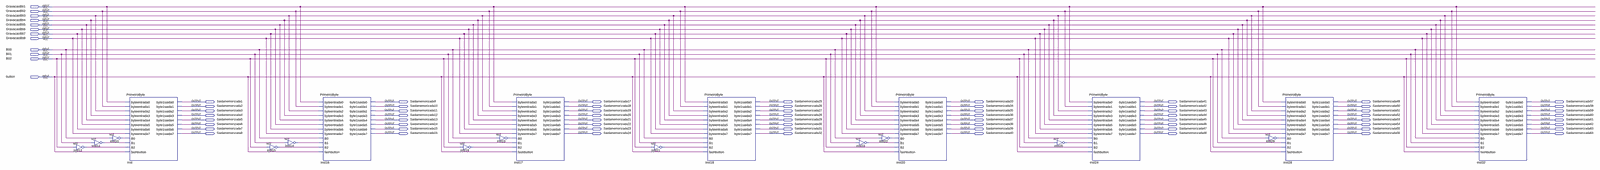
[diagram p0: schematic sheet, whole]
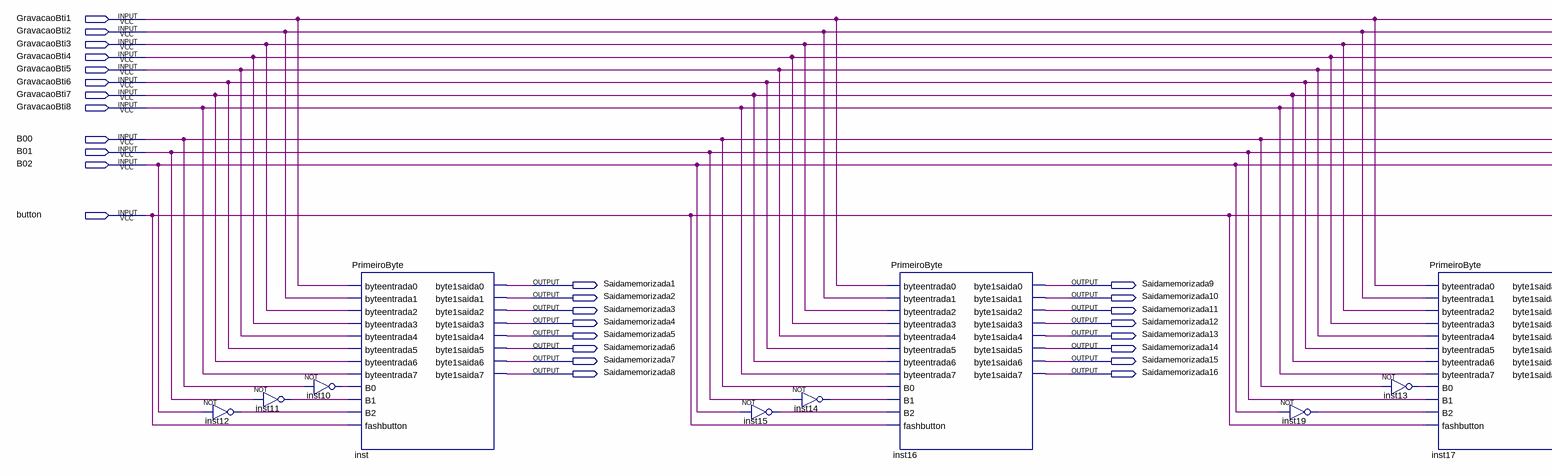
[diagram p1: schematic sheet, left part]
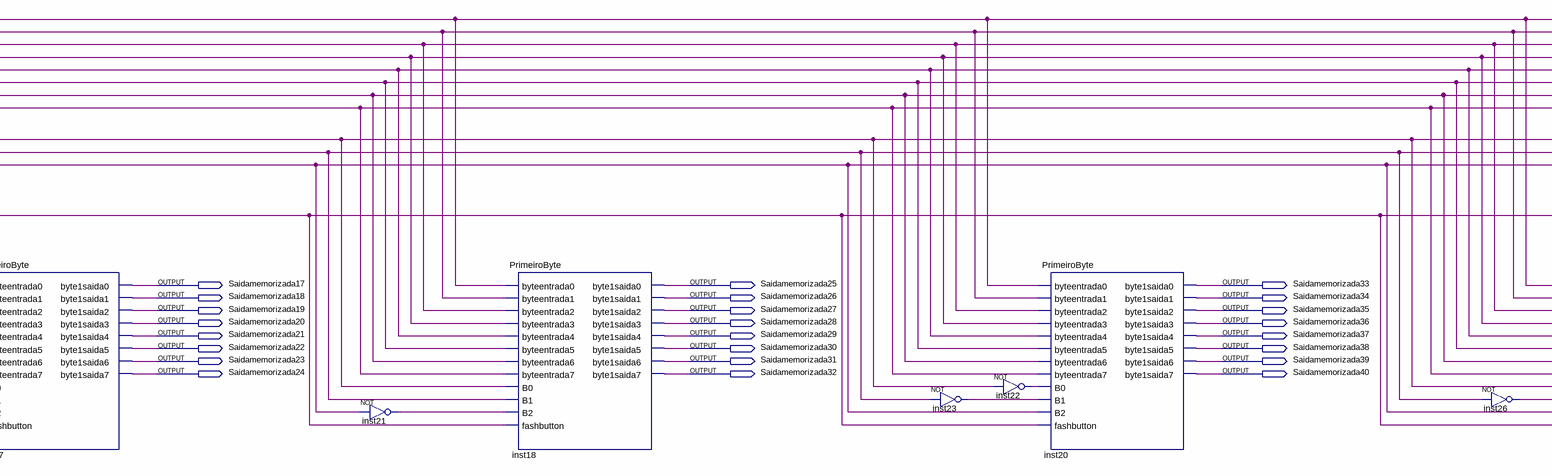
[diagram p2: schematic sheet, centre part]
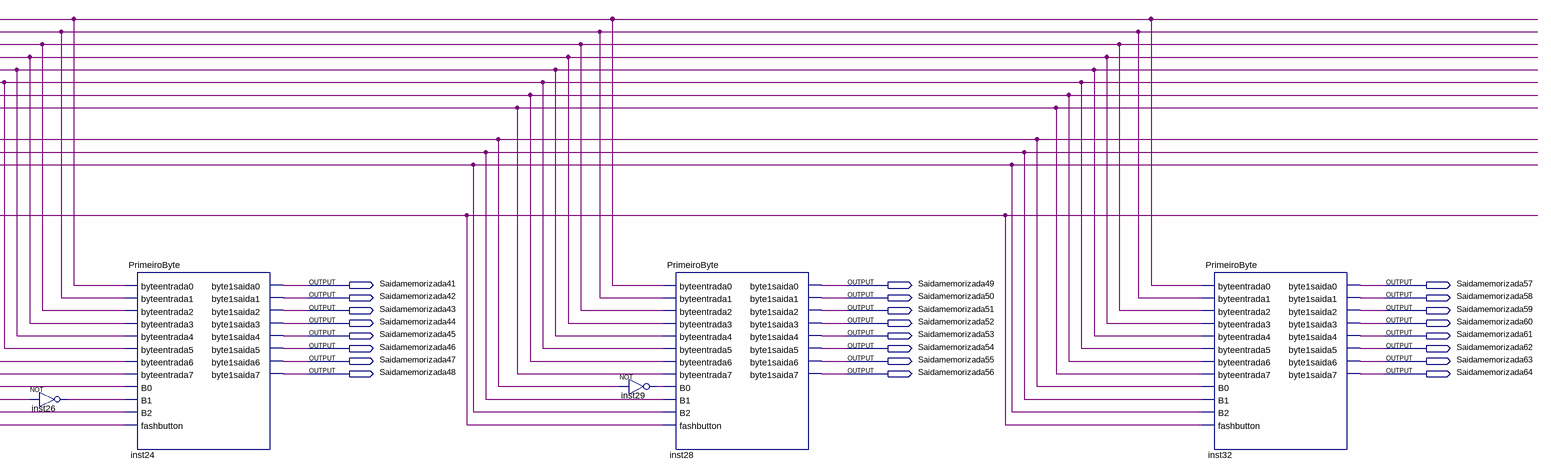
[diagram p3: schematic sheet, right part]
// Quartus schematic MemoriaBiestavel.bdf as structural Verilog: 20 symbols, 76 pins
module MemoriaBiestavel (
  input  GravacaoBti1,
  input  GravacaoBti2,
  input  GravacaoBti3,
  input  GravacaoBti4,
  input  GravacaoBti5,
  input  GravacaoBti6,
  input  GravacaoBti7,
  input  GravacaoBti8,
  input  B00,
  input  B01,
  input  B02,
  input  button,
  output Saidamemorizada1,
  output Saidamemorizada9,
  output Saidamemorizada17,
  output Saidamemorizada25,
  output Saidamemorizada33,
  output Saidamemorizada41,
  output Saidamemorizada49,
  output Saidamemorizada57,
  output Saidamemorizada2,
  output Saidamemorizada10,
  output Saidamemorizada18,
  output Saidamemorizada26,
  output Saidamemorizada34,
  output Saidamemorizada42,
  output Saidamemorizada50,
  output Saidamemorizada58,
  output Saidamemorizada3,
  output Saidamemorizada11,
  output Saidamemorizada19,
  output Saidamemorizada27,
  output Saidamemorizada35,
  output Saidamemorizada43,
  output Saidamemorizada51,
  output Saidamemorizada59,
  output Saidamemorizada4,
  output Saidamemorizada12,
  output Saidamemorizada20,
  output Saidamemorizada28,
  output Saidamemorizada36,
  output Saidamemorizada44,
  output Saidamemorizada52,
  output Saidamemorizada60,
  output Saidamemorizada5,
  output Saidamemorizada13,
  output Saidamemorizada21,
  output Saidamemorizada29,
  output Saidamemorizada37,
  output Saidamemorizada45,
  output Saidamemorizada53,
  output Saidamemorizada61,
  output Saidamemorizada6,
  output Saidamemorizada14,
  output Saidamemorizada22,
  output Saidamemorizada30,
  output Saidamemorizada38,
  output Saidamemorizada46,
  output Saidamemorizada54,
  output Saidamemorizada62,
  output Saidamemorizada7,
  output Saidamemorizada15,
  output Saidamemorizada23,
  output Saidamemorizada31,
  output Saidamemorizada39,
  output Saidamemorizada47,
  output Saidamemorizada55,
  output Saidamemorizada63,
  output Saidamemorizada8,
  output Saidamemorizada16,
  output Saidamemorizada24,
  output Saidamemorizada32,
  output Saidamemorizada40,
  output Saidamemorizada48,
  output Saidamemorizada56,
  output Saidamemorizada64
);

  wire inst10_out, inst11_out, inst12_out, inst13_out, inst14_out, inst15_out, inst19_out, inst21_out,
       inst22_out, inst23_out, inst26_out, inst29_out;

  not inst12 (inst12_out, B02);
  not inst11 (inst11_out, B01);
  not inst10 (inst10_out, B00);
  PrimeiroByte inst (
    .byteentrada0(GravacaoBti1), .byteentrada1(GravacaoBti2), .byteentrada2(GravacaoBti3),
    .byteentrada3(GravacaoBti4), .byteentrada4(GravacaoBti5), .byteentrada5(GravacaoBti6),
    .byteentrada6(GravacaoBti7), .byteentrada7(GravacaoBti8), .B0(inst10_out), .B1(inst11_out),
    .B2(inst12_out), .fashbutton(button), .byte1saida0(Saidamemorizada1), .byte1saida1(Saidamemorizada2),
    .byte1saida2(Saidamemorizada3), .byte1saida3(Saidamemorizada4), .byte1saida4(Saidamemorizada5),
    .byte1saida5(Saidamemorizada6), .byte1saida6(Saidamemorizada7), .byte1saida7(Saidamemorizada8));
  not inst15 (inst15_out, B02);
  not inst14 (inst14_out, B01);
  PrimeiroByte inst16 (
    .byteentrada0(GravacaoBti1), .byteentrada1(GravacaoBti2), .byteentrada2(GravacaoBti3),
    .byteentrada3(GravacaoBti4), .byteentrada4(GravacaoBti5), .byteentrada5(GravacaoBti6),
    .byteentrada6(GravacaoBti7), .byteentrada7(GravacaoBti8), .B0(B00), .B1(inst14_out), .B2(inst15_out),
    .fashbutton(button), .byte1saida0(Saidamemorizada9), .byte1saida1(Saidamemorizada10),
    .byte1saida2(Saidamemorizada11), .byte1saida3(Saidamemorizada12), .byte1saida4(Saidamemorizada13),
    .byte1saida5(Saidamemorizada14), .byte1saida6(Saidamemorizada15), .byte1saida7(Saidamemorizada16));
  not inst19 (inst19_out, B02);
  PrimeiroByte inst17 (
    .byteentrada0(GravacaoBti1), .byteentrada1(GravacaoBti2), .byteentrada2(GravacaoBti3),
    .byteentrada3(GravacaoBti4), .byteentrada4(GravacaoBti5), .byteentrada5(GravacaoBti6),
    .byteentrada6(GravacaoBti7), .byteentrada7(GravacaoBti8), .B0(inst13_out), .B1(B01), .B2(inst19_out),
    .fashbutton(button), .byte1saida0(Saidamemorizada17), .byte1saida1(Saidamemorizada18),
    .byte1saida2(Saidamemorizada19), .byte1saida3(Saidamemorizada20), .byte1saida4(Saidamemorizada21),
    .byte1saida5(Saidamemorizada22), .byte1saida6(Saidamemorizada23), .byte1saida7(Saidamemorizada24));
  not inst13 (inst13_out, B00);
  not inst21 (inst21_out, B02);
  PrimeiroByte inst18 (
    .byteentrada0(GravacaoBti1), .byteentrada1(GravacaoBti2), .byteentrada2(GravacaoBti3),
    .byteentrada3(GravacaoBti4), .byteentrada4(GravacaoBti5), .byteentrada5(GravacaoBti6),
    .byteentrada6(GravacaoBti7), .byteentrada7(GravacaoBti8), .B0(B00), .B1(B01), .B2(inst21_out),
    .fashbutton(button), .byte1saida0(Saidamemorizada25), .byte1saida1(Saidamemorizada26),
    .byte1saida2(Saidamemorizada27), .byte1saida3(Saidamemorizada28), .byte1saida4(Saidamemorizada29),
    .byte1saida5(Saidamemorizada30), .byte1saida6(Saidamemorizada31), .byte1saida7(Saidamemorizada32));
  not inst23 (inst23_out, B01);
  PrimeiroByte inst20 (
    .byteentrada0(GravacaoBti1), .byteentrada1(GravacaoBti2), .byteentrada2(GravacaoBti3),
    .byteentrada3(GravacaoBti4), .byteentrada4(GravacaoBti5), .byteentrada5(GravacaoBti6),
    .byteentrada6(GravacaoBti7), .byteentrada7(GravacaoBti8), .B0(inst22_out), .B1(inst23_out), .B2(B02),
    .fashbutton(button), .byte1saida0(Saidamemorizada33), .byte1saida1(Saidamemorizada34),
    .byte1saida2(Saidamemorizada35), .byte1saida3(Saidamemorizada36), .byte1saida4(Saidamemorizada37),
    .byte1saida5(Saidamemorizada38), .byte1saida6(Saidamemorizada39), .byte1saida7(Saidamemorizada40));
  not inst22 (inst22_out, B00);
  not inst26 (inst26_out, B01);
  PrimeiroByte inst24 (
    .byteentrada0(GravacaoBti1), .byteentrada1(GravacaoBti2), .byteentrada2(GravacaoBti3),
    .byteentrada3(GravacaoBti4), .byteentrada4(GravacaoBti5), .byteentrada5(GravacaoBti6),
    .byteentrada6(GravacaoBti7), .byteentrada7(GravacaoBti8), .B0(B00), .B1(inst26_out), .B2(B02),
    .fashbutton(button), .byte1saida0(Saidamemorizada41), .byte1saida1(Saidamemorizada42),
    .byte1saida2(Saidamemorizada43), .byte1saida3(Saidamemorizada44), .byte1saida4(Saidamemorizada45),
    .byte1saida5(Saidamemorizada46), .byte1saida6(Saidamemorizada47), .byte1saida7(Saidamemorizada48));
  not inst29 (inst29_out, B00);
  PrimeiroByte inst28 (
    .byteentrada0(GravacaoBti1), .byteentrada1(GravacaoBti2), .byteentrada2(GravacaoBti3),
    .byteentrada3(GravacaoBti4), .byteentrada4(GravacaoBti5), .byteentrada5(GravacaoBti6),
    .byteentrada6(GravacaoBti7), .byteentrada7(GravacaoBti8), .B0(inst29_out), .B1(B01), .B2(B02),
    .fashbutton(button), .byte1saida0(Saidamemorizada49), .byte1saida1(Saidamemorizada50),
    .byte1saida2(Saidamemorizada51), .byte1saida3(Saidamemorizada52), .byte1saida4(Saidamemorizada53),
    .byte1saida5(Saidamemorizada54), .byte1saida6(Saidamemorizada55), .byte1saida7(Saidamemorizada56));
  PrimeiroByte inst32 (
    .byteentrada0(GravacaoBti1), .byteentrada1(GravacaoBti2), .byteentrada2(GravacaoBti3),
    .byteentrada3(GravacaoBti4), .byteentrada4(GravacaoBti5), .byteentrada5(GravacaoBti6),
    .byteentrada6(GravacaoBti7), .byteentrada7(GravacaoBti8), .B0(B00), .B1(B01), .B2(B02),
    .fashbutton(button), .byte1saida0(Saidamemorizada57), .byte1saida1(Saidamemorizada58),
    .byte1saida2(Saidamemorizada59), .byte1saida3(Saidamemorizada60), .byte1saida4(Saidamemorizada61),
    .byte1saida5(Saidamemorizada62), .byte1saida6(Saidamemorizada63), .byte1saida7(Saidamemorizada64));
endmodule
